# EasyEDA Pro project bandolibre.eprj, schematic WingLeft
Board Name: WingLeft; Create Date: 2026-09-07; Page Name: P1; Project Name: bandolibre; Schematic Name: WingLeft; Update Date: 2026-09-07; Company: Pierre Labatut; Page Size: A4; Version: V1.0
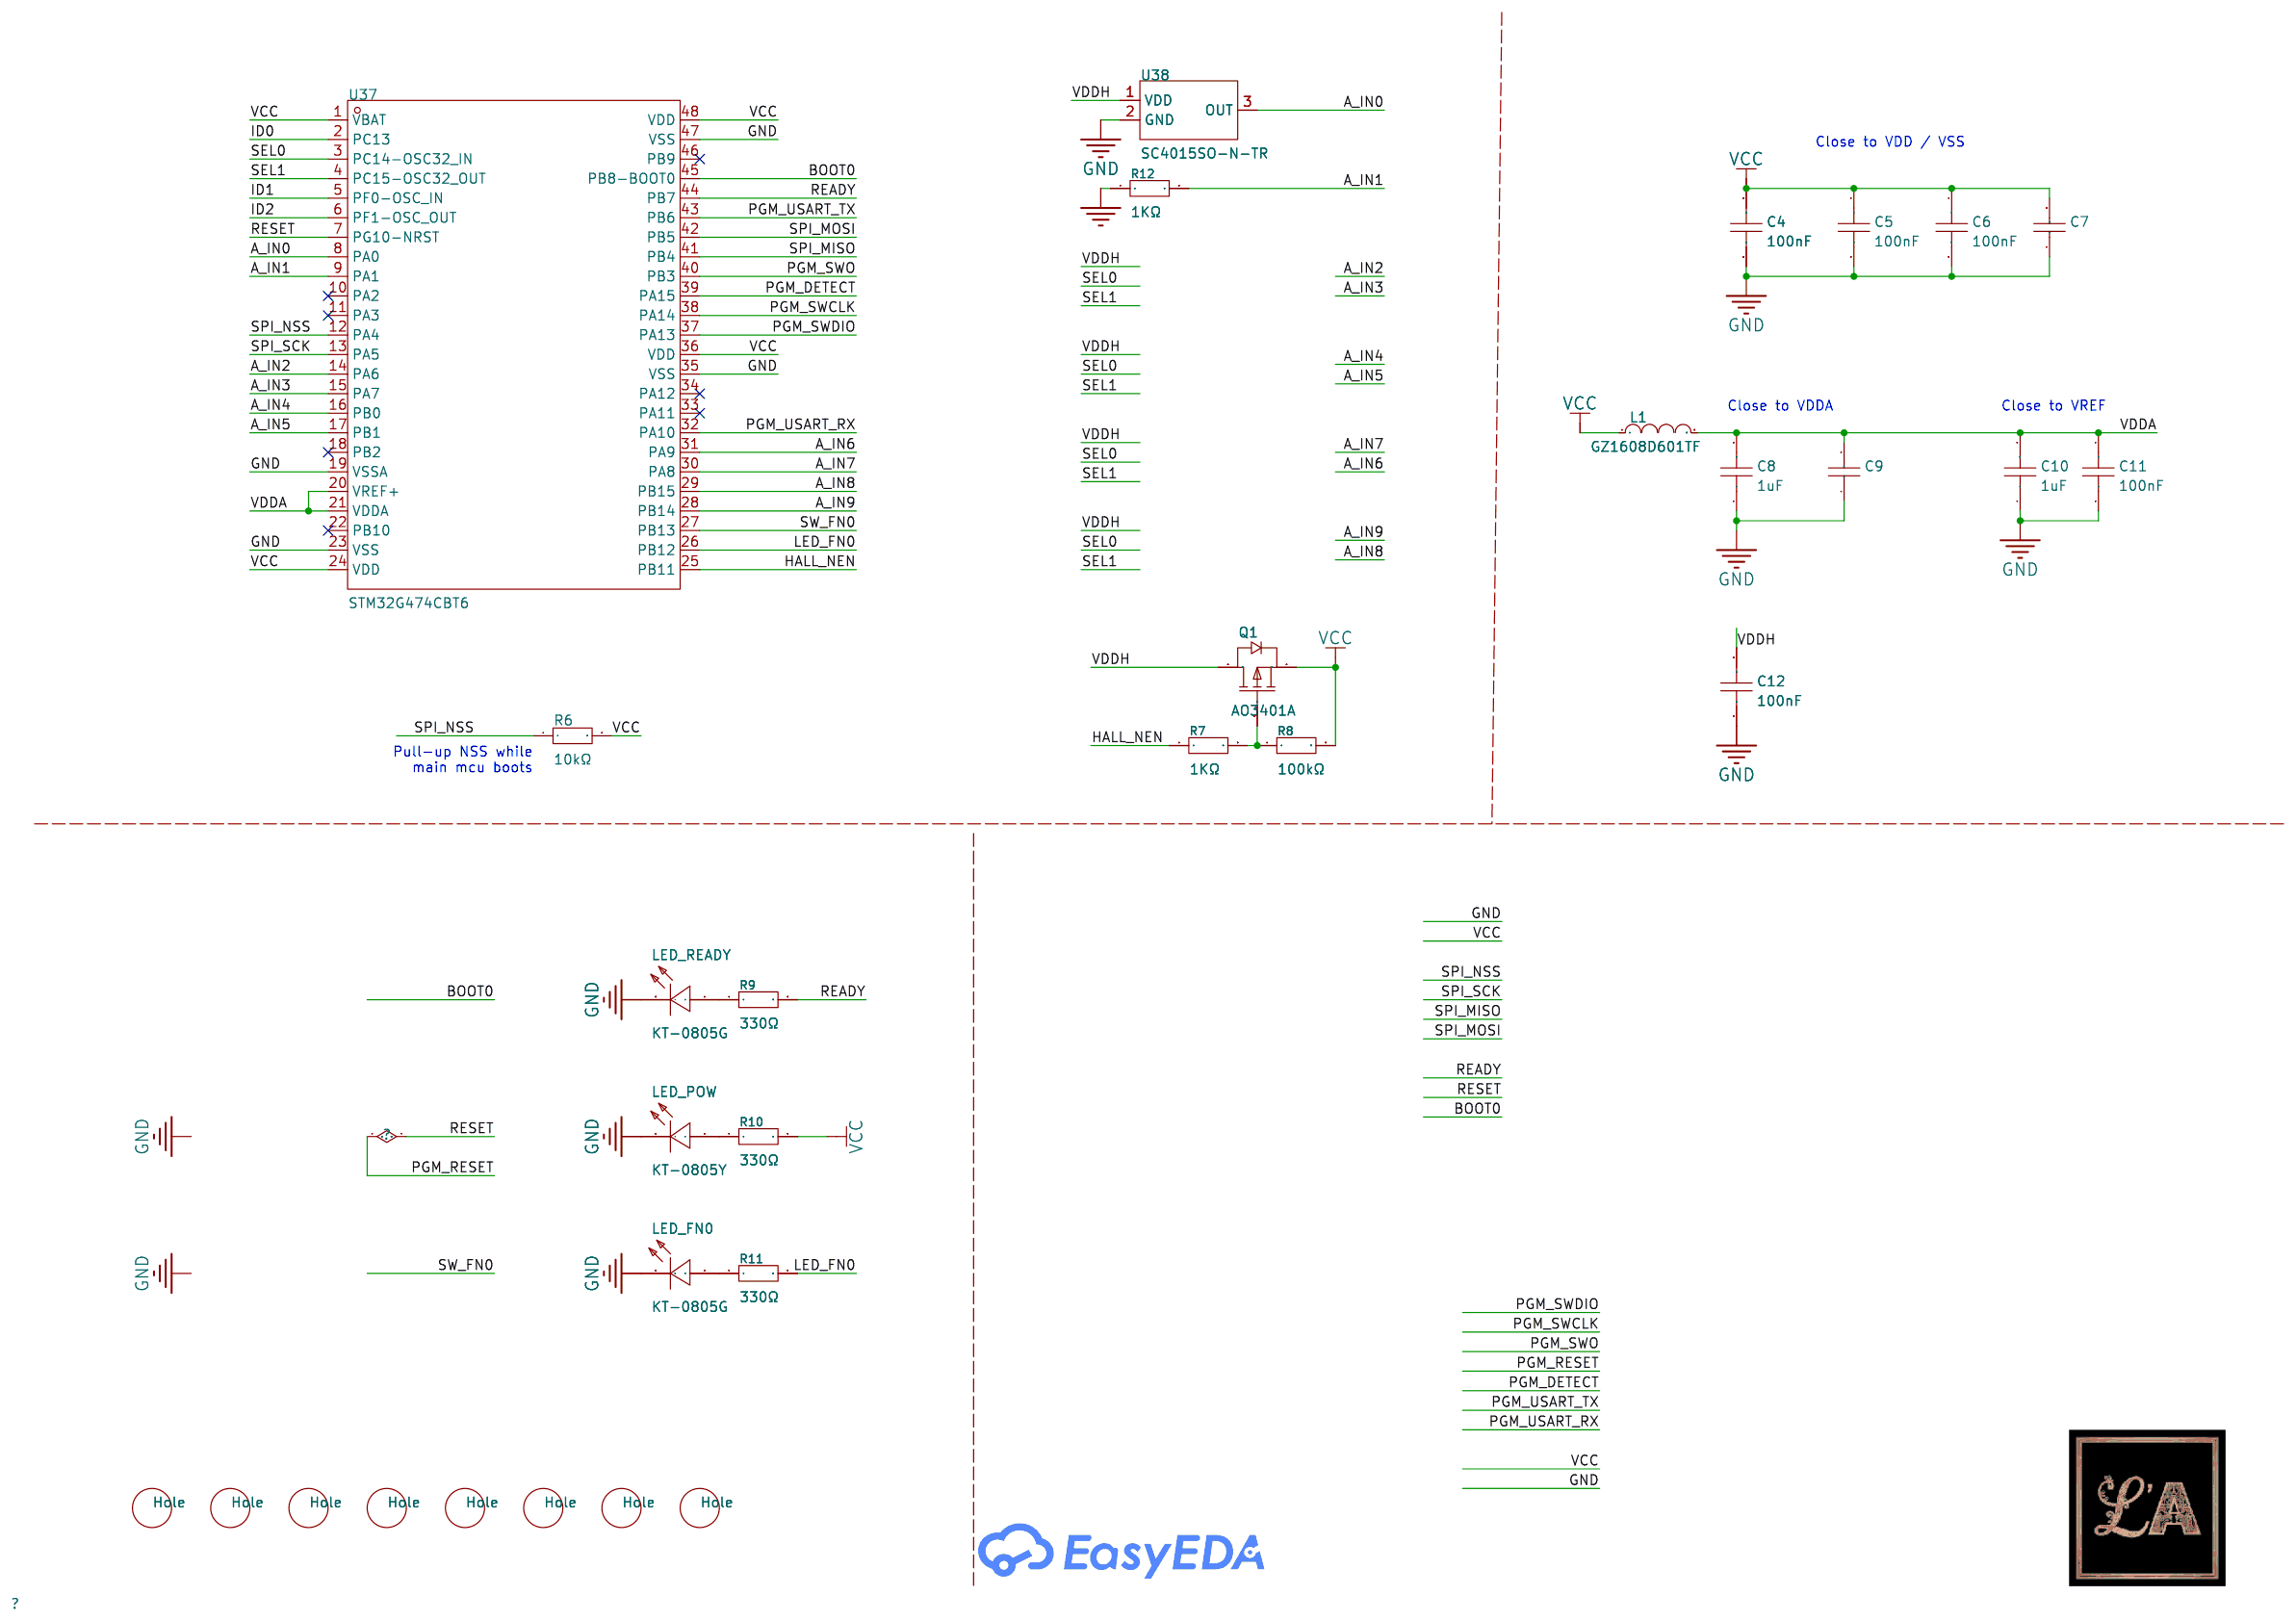
[diagram p9: schematic sheet]

## Parts
BOOT  -
C4  100nF  [C0402]
C5  100nF  [C0402]
C6  100nF  [C0402]
C7  4.7uF  [C0805]
C8  1uF  [C0402]
C9  10nF  [C0402]
C10  1uF  [C0402]
C11  100nF  [C0402]
C12  100nF  [C0603]
CARTOUCHE1  -  [ABL_Cartouche]  (no BOM)
CBB1  -
CBB2  -
CBB3  -
CBB4  -
CBB5  -
CBB6  -
CBB8  -
CBB9  -
CBB10  -
H1  Hole  [HOLE_M3_H12]  (no BOM)
H2  Hole  [HOLE_M3_H12]  (no BOM)
H3  Hole  [HOLE_M3_H12]  (no BOM)
H4  Hole  [HOLE_M3_H12]  (no BOM)
H5  Hole  [HOLE_M3_H12]  (no BOM)
H6  Hole  [HOLE_M3_H12]  (no BOM)
H7  Hole  [HOLE_M3_H12]  (no BOM)
H8  Hole  [HOLE_M3_H12]  (no BOM)
L1  GZ1608D601TF  [L0603]
LED_FN0  KT-0805G  [LED0805-R-RD]
LED_POW  KT-0805Y  [LED0805-R-RD]
LED_READY  KT-0805G  [LED0805-R-RD]
Q1  AO3401A  [SOT-23_L2.9-W1.3-P1.90-LS2.4-BR]
R6  10kΩ  [R0603]
R7  1KΩ  [R0603]
R8  100kΩ  [R0603]
R9  330Ω  [R0603]
R10  330Ω  [R0603]
R11  330Ω  [R0603]
R12  1KΩ  [R0603]
RESET  -
SW_FN0  -
U37  STM32G474CBT6  [LQFP-48_L7.0-W7.0-P0.50-LS9.0-BL]
U38  SC4015SO-N-TR  [SOT-23-Switch]

## Library data of the parts
C4-C6 C11 = CL05B104KO5NNNC: Capacitance: Tolerance:±10% Tolerance:±10% Voltage Rated: Temperature Coefficient:; LCSC Part Name: 100nF ±10% 16V; Supplier Part: C1525; Manufacturer: SAMSUNG(三星); Supplier Footprint: 0402; JLCPCB Part Class: Basic Part; Datasheet: https://atta.szlcsc.com/upload/public/pdf/source/20160218/1457707763339.pdf; Supplier: LCSC; Tolerance: ±10%
C7 = CL21A475KAQNNNE: Capacitance: Tolerance:±10% Tolerance:±10% Voltage Rated: Temperature Coefficient:; LCSC Part Name: 4.7uF ±10% 25V; Supplier Part: C1779; Manufacturer: SAMSUNG(三星); Supplier Footprint: 0805; JLCPCB Part Class: Basic Part; Datasheet: https://atta.szlcsc.com/upload/public/pdf/source/20160103/1457707696447.pdf; Supplier: LCSC; Tolerance: ±10%
C8 C10 = CL05A105KA5NQNC: Capacitance: Tolerance:±10% Tolerance:±10% Voltage Rated: Temperature Coefficient:; LCSC Part Name: 1uF ±10% 25V; Supplier Part: C52923; Manufacturer: SAMSUNG(三星); Supplier Footprint: 0402; JLCPCB Part Class: Basic Part; Datasheet: https://atta.szlcsc.com/upload/public/pdf/source/20160218/1457707763339.pdf; Supplier: LCSC; Tolerance: ±10%
C9 = CL05B103KB5NNNC: Capacitance: Tolerance:±10% Tolerance:±10% Voltage Rated: Temperature Coefficient:; LCSC Part Name: 10nF ±10% 50V; Supplier Part: C15195; Manufacturer: SAMSUNG(三星); Supplier Footprint: 0402; JLCPCB Part Class: Basic Part; Datasheet: https://atta.szlcsc.com/upload/public/pdf/source/20160218/1457707763339.pdf; Supplier: LCSC; Tolerance: ±10%
C12 = CC0603KRX7R9BB104: Capacitance: Tolerance:±10% Tolerance:±10% Voltage Rated: Temperature Coefficient:; LCSC Part Name: 100nF ±10% 50V; Supplier Part: C14663; Manufacturer: YAGEO(国巨); Supplier Footprint: 0603; JLCPCB Part Class: Basic Part; Datasheet: https://atta.szlcsc.com/upload/public/pdf/source/20170116/1484561234239.pdf; Supplier: LCSC; Tolerance: ±10%
CARTOUCHE1 = ABL_Cartouche: Design Version: v1.0-alpha; Design Name: Bandolibre Left Wing
H1-H8 = HOLE_M3_H12: Hole for fine adjustment.
L1 = GZ1608D601TF: Impedance @ Frequency:600Ω@100MHz Tolerance:±25% Tolerance:±25% DC Resistance(DCR):450mΩ Current Rating:200mA Number of Circuits:1 Operating Temperature:-55℃~+125℃ Operating Temperature:-55℃~+125℃; LCSC Part Name: 单路 0603磁珠 阻抗600Ω@100MHz; Supplier Part: C1002; Manufacturer: Sunlord(顺络); Supplier Footprint: 0603; JLCPCB Part Class: Basic Part; Datasheet: https://item.szlcsc.com/datasheet/GZ1608D601TF/1354.html; Supplier: LCSC; Impedance @ Frequency: 600Ω@100MHz; Tolerance: ±25%; DC Resistance(DCR): 450mΩ; Current Rating: 200mA; Number of Circuits: 1; Operating Temperature: -55℃~+125℃
LED_FN0 = KT-0805G: Lamp Holder Type:2mm x 1.25mm square LED Illumination Color:Emerald Green Voltage - Forward(Vf):2.6V~3.1V Voltage - Forward(Vf):2.6V~3.1V Power(Watts):100mW Forward Current:5mA Wavelength - Dominant:513nm~528nm Wavelength - Dominant:513nm~528nm Peak Wavel; LCSC Part Name: 0805 翠绿 高亮; Supplier Part: C2297; Manufacturer: KENTO; Supplier Footprint: 0805; JLCPCB Part Class: Basic Part; Datasheet: https://item.szlcsc.com/datasheet/KT-0805G/2670.html; Supplier: LCSC; Lamp Holder Type: 2mm x 1.25mm square LED; Illumination Color: Emerald Green; Voltage - Forward(Vf): 2.6V~3.1V; Power(Watts): 100mW; Forward Current: 5mA; Wavelength - Dominant: 513nm~528nm; Peak Wavelength: 525nm; Diode Configuration: Discrete Diode; Lens Color: Water Clear; Luminous Intensity: 430mcd; Viewing Angle: 120°; Operating Temperature: -40℃~+85℃
LED_POW = KT-0805Y: Illumination Color:Yellow Voltage - Forward(Vf):1.8V~2.4V Voltage - Forward(Vf):1.8V~2.4V Power(Watts):40mW Forward Current:- Wavelength - Dominant:584nm~594nm Wavelength - Dominant:584nm~594nm Peak Wavelength:596nm Diode Configuration:- Lens Color:Water; LCSC Part Name: 0805 黄灯 高亮; Supplier Part: C2296; Manufacturer: KENTO; Supplier Footprint: 0805; JLCPCB Part Class: Basic Part; Datasheet: https://item.szlcsc.com/datasheet/KT-0805Y/2669.html; Supplier: LCSC; Illumination Color: Yellow; Voltage - Forward(Vf): 1.8V~2.4V; Power(Watts): 40mW; Wavelength - Dominant: 584nm~594nm; Peak Wavelength: 596nm; Lens Color: Water Clear; Luminous Intensity: 175mcd; Viewing Angle: 120°; Operating Temperature: -40℃~+85℃
LED_READY = KT-0805G: Lamp Holder Type:2mm x 1.25mm square LED Illumination Color:Emerald Green Voltage - Forward(Vf):2.6V~3.1V Voltage - Forward(Vf):2.6V~3.1V Power(Watts):100mW Forward Current:5mA Wavelength - Dominant:513nm~528nm Wavelength - Dominant:513nm~528nm Peak Wavel; LCSC Part Name: 0805 翠绿 高亮; Supplier Part: C2297; Manufacturer: KENTO; Supplier Footprint: 0805; JLCPCB Part Class: Basic Part; Datasheet: https://item.szlcsc.com/datasheet/KT-0805G/2670.html; Supplier: LCSC; Illumination Color: Emerald Green; Voltage - Forward(Vf): 2.6V~3.1V; Power(Watts): 100mW; Forward Current: 5mA; Wavelength - Dominant: 513nm~528nm; Peak Wavelength: 525nm; Diode Configuration: Discrete Diode; Lens Color: Water Clear; Luminous Intensity: 430mcd; Viewing Angle: 120°; Operating Temperature: -40℃~+85℃
Q1 = AO3401A_C15127: Number:1 P-Channel Drain to Source Voltage:30V Current - Continuous Drain(Id):4A RDS(on):47mΩ@10V；85mΩ@2.5V；60mΩ@4.5V Pd - Power Dissipation:- Gate Threshold Voltage (Vgs(th)):900mV Gate Charge(Qg):14nC@10V Input Capacitance(Ciss):645pF Reverse Transfer C; LCSC Part Name: 1个P沟道 耐压:30V 电流:4A; Supplier Part: C15127; Manufacturer: AOS; Supplier Footprint: SOT-23; JLCPCB Part Class: Basic Part; Datasheet: https://item.szlcsc.com/datasheet/AO3401A/15801.html; Supplier: LCSC; Number: 1 P-Channel; Drain to Source Voltage: 30V; Current - Continuous Drain(Id): 4A; RDS(on): 47mΩ@10V；85mΩ@2.5V；60mΩ@4.5V; Gate Threshold Voltage (Vgs(th)): 900mV; Gate Charge(Qg): 14nC@10V; Input Capacitance(Ciss): 645pF; Reverse Transfer Capacitance (Crss@Vds): 55pF; Output Capacitance(Coss): 80pF
R6 = 0603WAF1002T5E: Type:Thick Film Resistor Resistance:10kΩ Tolerance:±1% Tolerance:±1% Power(Watts):100mW Voltage-Supply(Max):75V Temperature Coefficient:±100ppm/℃ Temperature Coefficient:±100ppm/℃ Operating Temperature:-55℃~+155℃ Operating Temperature:-55℃~+155℃; LCSC Part Name: 厚膜电阻 10kΩ ±1% 100mW; Supplier Part: C25804; Manufacturer: UNI-ROYAL(厚声); Supplier Footprint: 0603; JLCPCB Part Class: Basic Part; Datasheet: https://item.szlcsc.com/datasheet/0603WAF1002T5E/26547.html; Supplier: LCSC; Type: Thick Film Resistor; Tolerance: ±1%; Power(Watts): 100mW; Voltage-Supply(Max): 75V; Temperature Coefficient: ±100ppm/℃; Operating Temperature: -55℃~+155℃
R7 R12 = 0603WAF1001T5E: LCSC Part Name: 1KΩ(1001) ±1% 编带; Supplier Part: C21190; Manufacturer: UNI-ROYAL(厚声); Supplier Footprint: 0603; JLCPCB Part Class: Basic Part; Datasheet: https://atta.szlcsc.com/upload/public/pdf/source/20170920/C21190_1505887441885980538.pdf; Supplier: LCSC
R8 = 0603WAF1003T5E: Type:Thick Film Resistors Resistance: Tolerance:±1% Tolerance:±1% Power(Watts): Temperature Coefficient:±100ppm/℃ Temperature Coefficient:±100ppm/℃ Overload Voltage (Max): Operating Temperature Range:-55℃~+155℃ Operating Temperature Range:-55℃~+155℃; LCSC Part Name: 100kΩ ±1% 100mW; Supplier Part: C25803; Manufacturer: UNI-ROYAL(厚声); Supplier Footprint: 0603; JLCPCB Part Class: Basic Part; Datasheet: https://atta.szlcsc.com/upload/public/pdf/source/20200306/C422600_1E6D84923E4A46A82E41ADD87F860B5C.pdf; Supplier: LCSC; Type: Thick Film Resistors; Tolerance: ±1%; Temperature Coefficient: ±100ppm/℃; Operating Temperature Range: -55℃~+155℃
R9-R11 = 0603WAF3300T5E: Type:Thick Film Resistors Resistance: Tolerance:±1% Tolerance:±1% Power(Watts): Overload Voltage (Max): Temperature Coefficient:±100ppm/℃ Temperature Coefficient:±100ppm/℃ Operating Temperature Range:-55℃~+155℃ Operating Temperature Range:-55℃~+155℃; LCSC Part Name: 330Ω ±1% 100mW 厚膜电阻; Supplier Part: C23138; Manufacturer: UNI-ROYAL(厚声); Supplier Footprint: 0603; JLCPCB Part Class: Basic Part; Datasheet: https://atta.szlcsc.com/upload/public/pdf/source/20200306/C422600_1E6D84923E4A46A82E41ADD87F860B5C.pdf; Supplier: LCSC; Type: Thick Film Resistors; Tolerance: ±1%; Temperature Coefficient: ±100ppm/℃; Operating Temperature Range: -55℃~+155℃
U37 = STM32G474CBT6: CPU Core:ARM Cortex-M4F CPU Maximum Speed:170MHz Core Size:32 Bit Program Storage Size:128KB Program Memory Type:FLASH RAM Size:128KB EEPROM:- Number of I/O:38 ADC (Bit):12bit DAC (Bit):12bit Oscillator Type:Built-in Voltage - Supply:1.71V~3.6V Voltage -; LCSC Part Name: Arm Cortex-M4 32位MCU+FPU，170 MHz/213 DMIPS，128 KB SRAM，丰富的模拟功能、数学加速器，184 ps 12通道高分辨率定时器; Supplier Part: C730123; Manufacturer: ST(意法半导体); Supplier Footprint: LQFP-48(7x7); JLCPCB Part Class: Extended Part; Datasheet: https://item.szlcsc.com/datasheet/STM32G474CBT6/778078.html; Supplier: LCSC; CPU Core: ARM Cortex-M4F; CPU Maximum Speed: 170MHz; Core Size: 32 Bit; Program Storage Size: 128KB; Program Memory Type: FLASH; RAM Size: 128KB; Number of I/O: 38; ADC (Bit): 12bit; DAC (Bit): 12bit; Oscillator Type: Built-in; Voltage - Supply: 1.71V~3.6V; Operating Temperature: -40℃~+85℃
U38 = SC4015SO-N-TR: Magnetic Field Range:±100mT Magnetic Field Range:±100mT Sensitivity:3.9mV/Gs Sensitivity Temperature Bleaching:- Sensitivity Temperature Bleaching:- Linearity:- Linearity:- Voltage - Supply:2.5V~5.5V Voltage - Supply:2.5V~5.5V Supply Current:2.5mA Operati; LCSC Part Name: 线性霍尔; Supplier Part: C49363171; Manufacturer: Semiment(赛卓); Supplier Footprint: SOT23-3L; JLCPCB Part Class: Extended Part; Datasheet: https://item.szlcsc.com/datasheet/SC4015SO-N-TR/51868409.html; Supplier: LCSC; Magnetic Field Range: ±100mT; Sensitivity: 3.9mV/Gs; Voltage - Supply: 2.5V~5.5V; Supply Current: 2.5mA; Operating Temperature: -40℃~+105℃

## Nets
GND: C4.1 C4.2 C5.1 C5.2 C6.1 C6.2 C7.1 C7.2 C8.1 C9.1 C10.1 C11.2 C12.1 CBB6.(GND) L1.1 LED_FN0.2(K) LED_POW.2(-) LED_READY.2(-) Q1.2(S) R6.2 R8.2 R10.2 R12.1 RESET.(OUT) SW_FN0.(OUT) U37.1(VBAT) U37.7(PG10-NRST) U37.19(VSSA) U37.23(VSS) U37.24(VDD) U37.27(PB13) U37.32(PA10) U37.35(VSS) U37.36(VDD) U37.37(PA13) U37.38(PA14) U37.39(PA15) U37.40(PB3) U37.43(PB6) U37.47(VSS) U37.48(VDD) U38.2(GND)
VDDA: C8.2 C9.2 C10.2 C11.1 L1.2 U37.20(VREF+) U37.21(VDDA)
A_IN0: U37.8(PA0) U38.3(OUT)
A_IN1: R12.2 U37.9(PA1)
A_IN2: C12.2 CBB1.(VDDH) CBB2.(VDDH) CBB3.(VDDH) CBB4.(VDDH) Q1.3(D) U37.3(PC14-OSC32_IN) U37.4(PC15-OSC32_OUT) U37.14(PA6) U37.15(PA7) U37.16(PB0) U37.17(PB1) U37.28(PB14) U37.29(PB15) U37.30(PA8) U37.31(PA9) U38.1(VDD)
BOOT0: BOOT.(SW_BOOT) U37.45(PB8-BOOT0)
HALL_NEN: R7.1 U37.25(PB11)
ID0: CBB9.(P_DOWN) U37.2(PC13)
ID1: CBB10.(P_UP) U37.5(PF0-OSC_IN)
ID2: CBB8.(P_DOWN) U37.6(PF1-OSC_OUT)
LED_FN0: R11.2 U37.26(PB12)
READY: R9.2 U37.44(PB7)
SPI_MISO: U37.41(PB4)
SPI_MOSI: U37.42(PB5)
SPI_NSS: R6.1 U37.12(PA4)
SPI_SCK: U37.13(PA5)
$1N21019: LED_FN0.1(A) R11.1
$1N21024: LED_POW.1(+) R10.1
$1N47002: Q1.1(G) R7.2 R8.1
$1N52732: LED_READY.1(+) R9.1

Not connected (* = marked no-connect by the designer): CBB5 1(GND) 2(VDD) 3(SPI_NSS) 4(SPI_SCK) 5(SPI_MISO) 6(SPI_MOSI) 7(READY) 8(NRST) 9(BOOT0); U37 10(PA2)* 11(PA3)* 18(PB2)* 22(PB10)* 33(PA11)* 34(PA12)* 46(PB9)*

## Notes on the sheet
- Close to VDD / VSS
- Close to VDDA
- Close to VREF
- Pull-up NSS while
  main mcu boots
